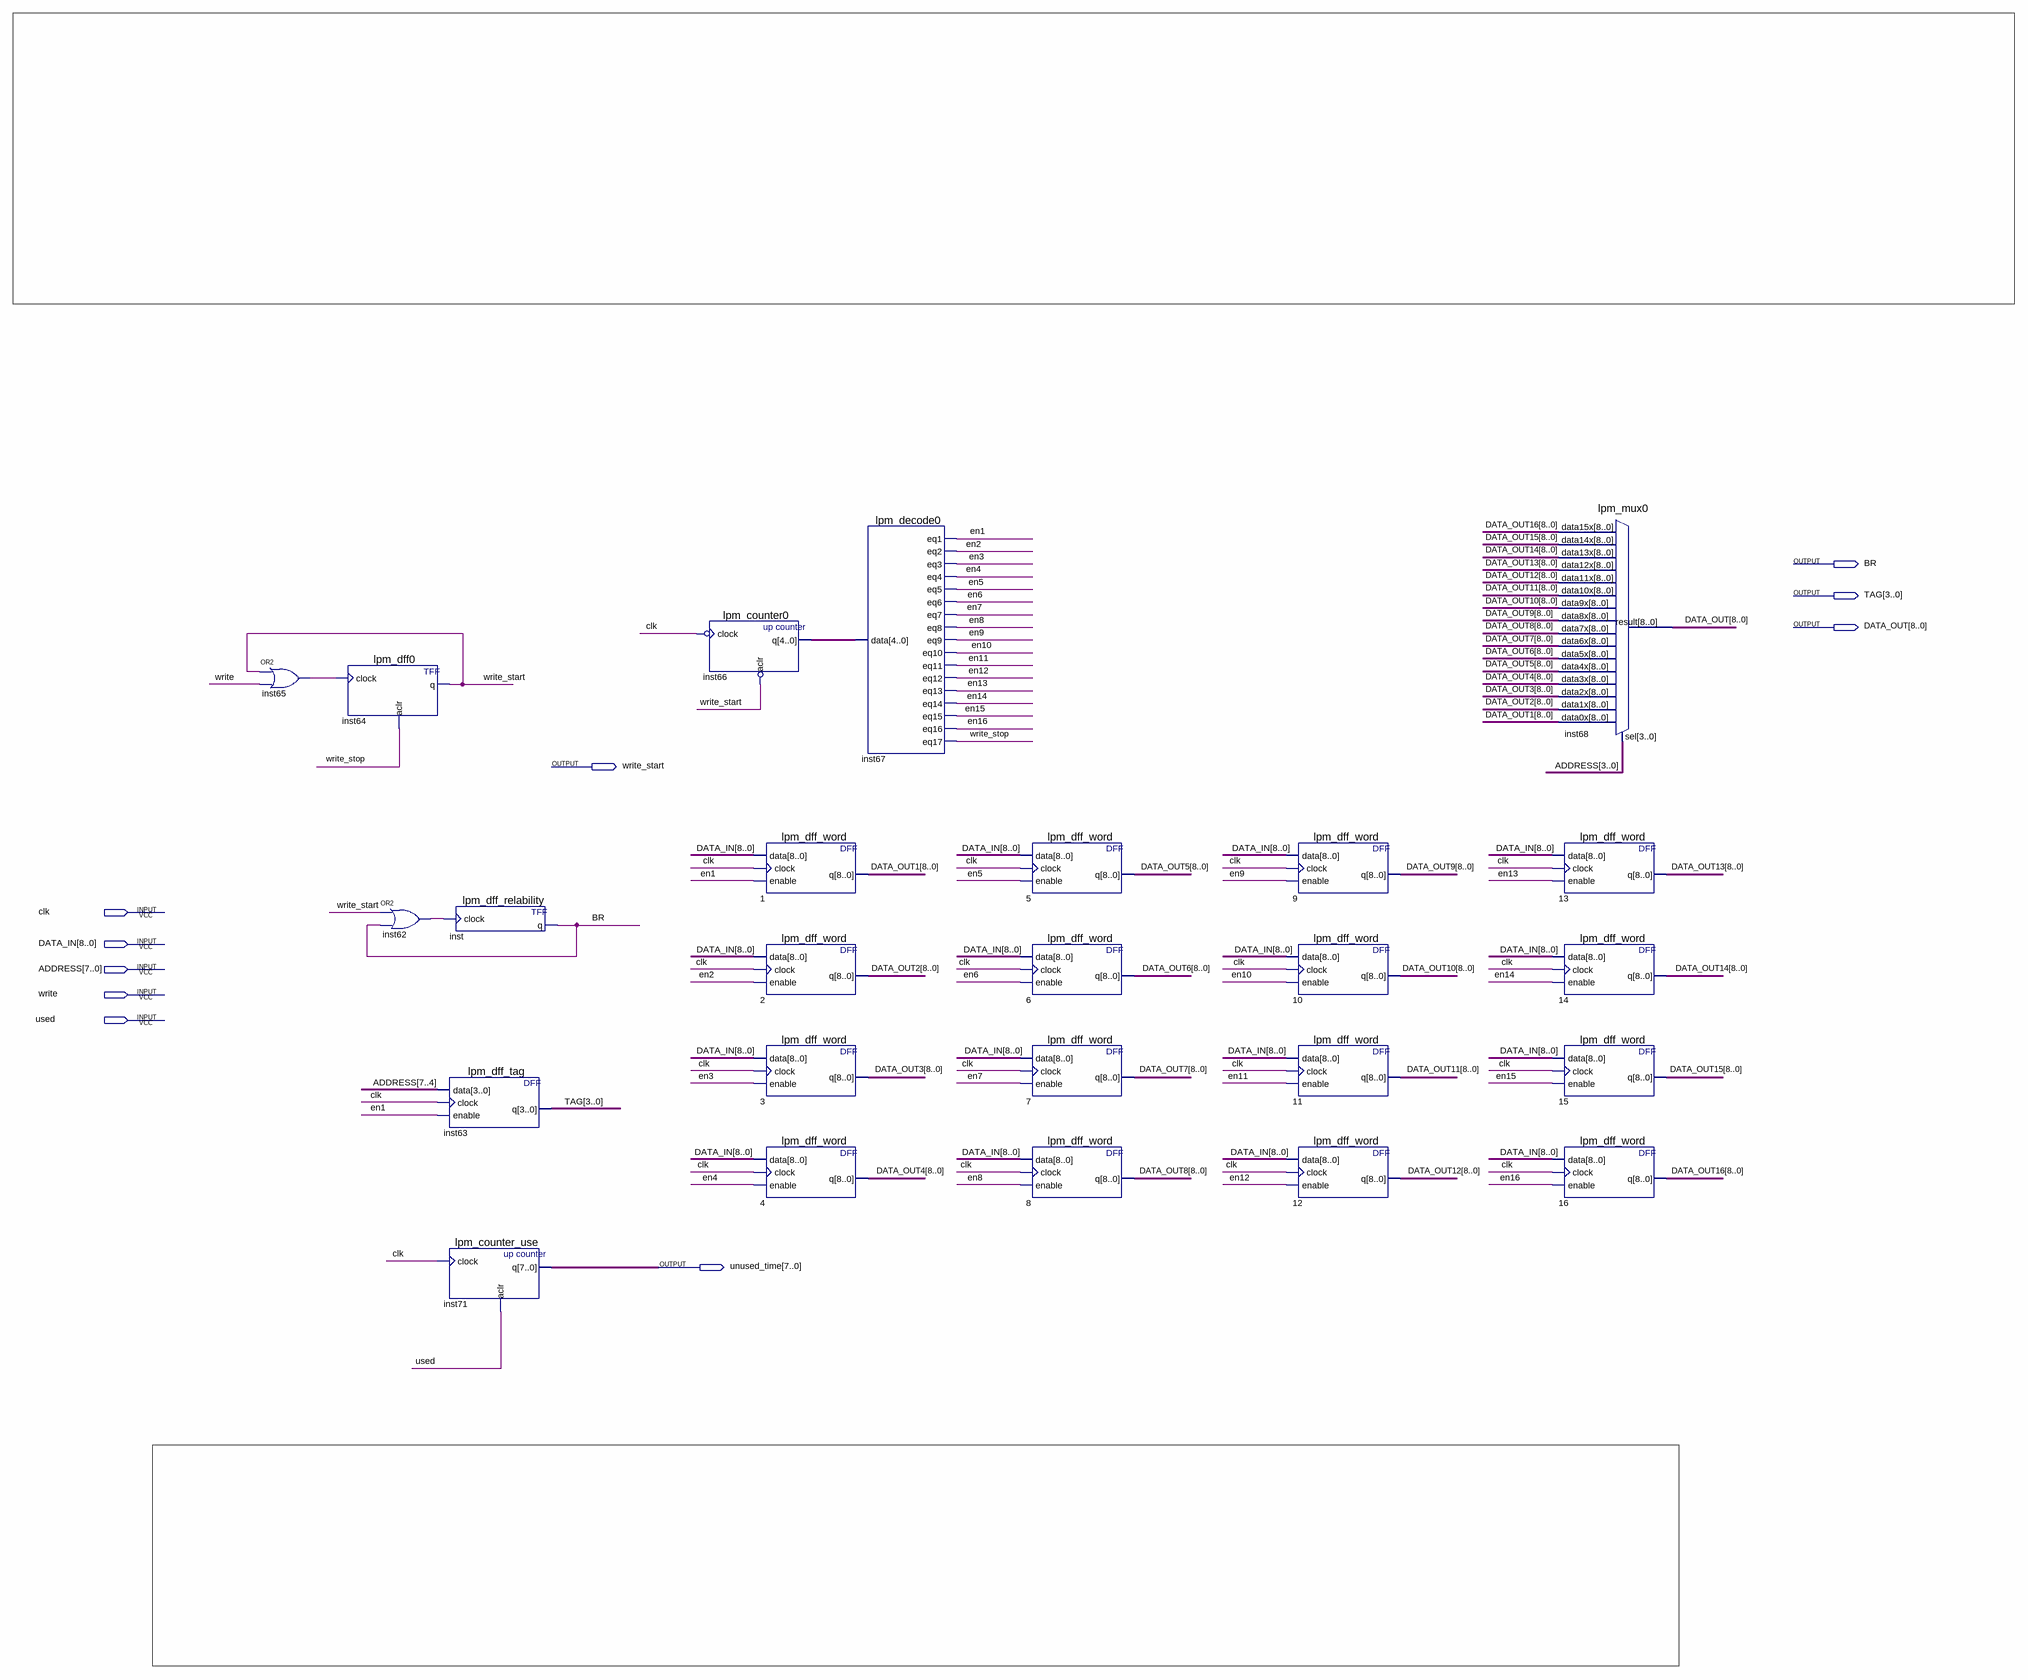
[diagram p0: schematic sheet]
// Quartus schematic string.bdf as structural Verilog: 25 symbols, 10 pins
module \string  (
  input  clk,
  input  [8:0] DATA_IN,
  input  [7:0] ADDRESS,
  input  write,
  input  used,
  output BR,
  output [3:0] TAG,
  output [8:0] DATA_OUT,
  output write_start,
  output [7:0] unused_time
);

  wire en1, en2, en3, en4, en5, en6, en7, en8, en9, en10, en11, en12, en13, en14, en15, en16, inst62_out,
       inst65_out, write_stop;
  wire [4:0] inst66_q;
  wire [8:0] DATA_OUT1, DATA_OUT2, DATA_OUT3, DATA_OUT4, DATA_OUT5, DATA_OUT6, DATA_OUT7, DATA_OUT8,
       DATA_OUT9, DATA_OUT10, DATA_OUT11, DATA_OUT12, DATA_OUT13, DATA_OUT14, DATA_OUT15, DATA_OUT16;

  or inst65 (inst65_out, write_start, write);
  lpm_dff0 inst64 (.clock(inst65_out), .aclr(write_stop), .q(write_start));
  or inst62 (inst62_out, write_start, BR);
  lpm_dff_relability inst (.clock(inst62_out), .q(BR));
  lpm_dff_tag inst63 (.data(ADDRESS[7:4]), .clock(clk), .enable(en1), .q(TAG));
  lpm_counter_use inst71 (.clock(clk), .aclr(used), .q(unused_time));
  lpm_counter0 inst66 (.clock(~clk), .aclr(~write_start), .q(inst66_q));
  lpm_dff_word u_1 (.data(DATA_IN), .clock(clk), .enable(en1), .q(DATA_OUT1));
  lpm_dff_word u_2 (.data(DATA_IN), .clock(clk), .enable(en2), .q(DATA_OUT2));
  lpm_dff_word u_3 (.data(DATA_IN), .clock(clk), .enable(en3), .q(DATA_OUT3));
  lpm_dff_word u_4 (.data(DATA_IN), .clock(clk), .enable(en4), .q(DATA_OUT4));
  lpm_decode0 inst67 (
    .data(inst66_q), .eq1(en1), .eq2(en2), .eq3(en3), .eq4(en4), .eq5(en5), .eq6(en6), .eq7(en7), .eq8(en8),
    .eq9(en9), .eq10(en10), .eq11(en11), .eq12(en12), .eq13(en13), .eq14(en14), .eq15(en15), .eq16(en16),
    .eq17(write_stop));
  lpm_dff_word u_5 (.data(DATA_IN), .clock(clk), .enable(en5), .q(DATA_OUT5));
  lpm_dff_word u_6 (.data(DATA_IN), .clock(clk), .enable(en6), .q(DATA_OUT6));
  lpm_dff_word u_7 (.data(DATA_IN), .clock(clk), .enable(en7), .q(DATA_OUT7));
  lpm_dff_word u_8 (.data(DATA_IN), .clock(clk), .enable(en8), .q(DATA_OUT8));
  lpm_dff_word u_9 (.data(DATA_IN), .clock(clk), .enable(en9), .q(DATA_OUT9));
  lpm_dff_word u_10 (.data(DATA_IN), .clock(clk), .enable(en10), .q(DATA_OUT10));
  lpm_dff_word u_11 (.data(DATA_IN), .clock(clk), .enable(en11), .q(DATA_OUT11));
  lpm_dff_word u_12 (.data(DATA_IN), .clock(clk), .enable(en12), .q(DATA_OUT12));
  lpm_mux0 inst68 (
    .data15x(DATA_OUT16), .data14x(DATA_OUT15), .data13x(DATA_OUT14), .data12x(DATA_OUT13),
    .data11x(DATA_OUT12), .data10x(DATA_OUT11), .data9x(DATA_OUT10), .data8x(DATA_OUT9), .data7x(DATA_OUT8),
    .data6x(DATA_OUT7), .data5x(DATA_OUT6), .data4x(DATA_OUT5), .data3x(DATA_OUT4), .data2x(DATA_OUT3),
    .data1x(DATA_OUT2), .data0x(DATA_OUT1), .sel(ADDRESS[3:0]), .result(DATA_OUT));
  lpm_dff_word u_13 (.data(DATA_IN), .clock(clk), .enable(en13), .q(DATA_OUT13));
  lpm_dff_word u_14 (.data(DATA_IN), .clock(clk), .enable(en14), .q(DATA_OUT14));
  lpm_dff_word u_15 (.data(DATA_IN), .clock(clk), .enable(en15), .q(DATA_OUT15));
  lpm_dff_word u_16 (.data(DATA_IN), .clock(clk), .enable(en16), .q(DATA_OUT16));
endmodule
